# EAGLE design jtag (EAGLE 5.06)
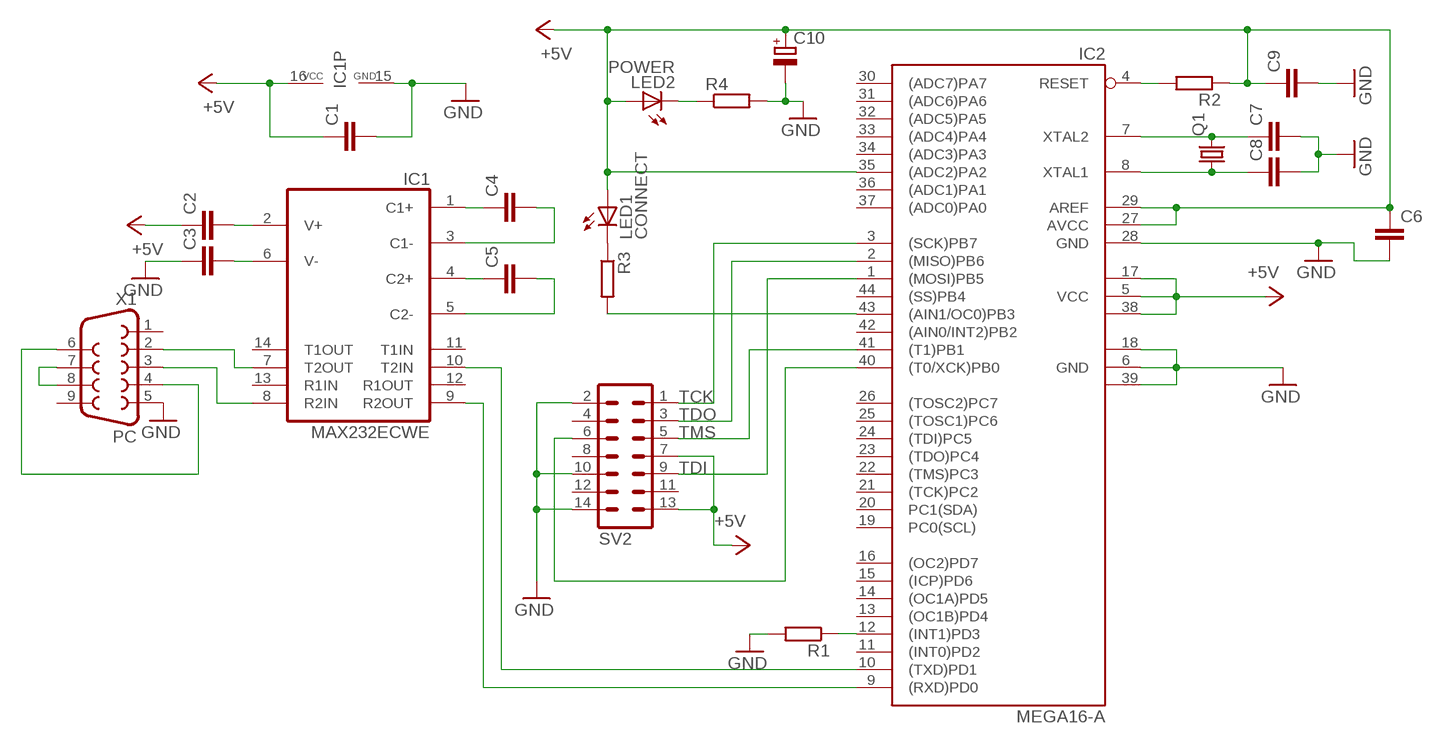
[diagram p0: schematic, sheet 1]

## Parts
C1  C-EUC0805  [C0805]
C2  C-EUC0805  [C0805]
C3  C-EUC0805  [C0805]
C4  C-EUC0805  [C0805]
C5  C-EUC0805  [C0805]
C6  C-EUC0805  [C0805]
C7  C-EUC0805  [C0805]
C8  C-EUC0805  [C0805]
C9  C-EUC0805  [C0805]
C10  CPOL-EUE5-5  [E5-5]
IC1  MAX232ECWE  [SO16L]
IC2  MEGA16-A  [TQFP44]
LED1  CONNECT  LEDCHIP-LED0805  [CHIP-LED0805]
LED2  POWER  LEDCHIP-LED0805  [CHIP-LED0805]
Q1  CRYSTALHC49S  [HC49/S]
R1  R-EU_R0805  [R0805]
R2  R-EU_R0805  [R0805]
R3  R-EU_R0805  [R0805]
R4  R-EU_R0805  [R0805]
SV2  MA07-2W  [MA07-2W]
X1  PC  F09HP  [F09HP]

## Nets
+5V: C1.1 C2.1 C6.1 C9.1 C10.+ IC1.16(VCC) IC2.5(VCC) IC2.17(VCC1) IC2.27(AVCC) IC2.29(AREF) IC2.35((ADC2)PA2) IC2.38(VCC2) LED1.A LED2.A R2.1 SV2.7 SV2.13
GND: C1.2 C3.1 C6.2 C7.2 C8.2 C9.2 C10.- IC1.15(GND) IC2.6(GND) IC2.18(GND1) IC2.28(GND) IC2.39(GND2) R1.2 R4.2 SV2.2 SV2.10 SV2.14 X1.5
N$1: X1.4 X1.6
N$2: X1.7 X1.8
N$3: IC1.7(T2OUT) X1.2
N$4: IC1.8(R2IN) X1.3
N$5: C5.2 IC1.5(C2-)
N$6: C2.2 IC1.2(V+)
N$7: C3.2 IC1.6(V-)
N$8: C4.1 IC1.1(C1+)
N$9: C4.2 IC1.3(C1-)
N$10: C5.1 IC1.4(C2+)
N$11: IC1.10(T2IN) IC2.10((TXD)PD1)
N$12: IC1.9(R2OUT) IC2.9((RXD)PD0)
N$13: IC2.12((INT1)PD3) R1.1
N$14: C7.1 IC2.7(XTAL2) Q1.2
N$15: C8.1 IC2.8(XTAL1) Q1.1
N$16: IC2.43((AIN1/OC0)PB3) R3.2
N$17: IC2.4(RESET) R2.2
N$18: LED1.C R3.1
N$20: IC2.40((T0/XCK)PB0) SV2.6
N$26: LED2.C R4.1
TCK: IC2.3((SCK)PB7) SV2.1
TDI: IC2.1((MOSI)PB5) SV2.9
TDO: IC2.2((MISO)PB6) SV2.3
TMS: IC2.41((T1)PB1) SV2.5
Unconnected: IC1.11(T1IN) IC1.12(R1OUT) IC1.13(R1IN) IC1.14(T1OUT) IC2.11((INT0)PD2) IC2.13((OC1B)PD4) IC2.14((OC1A)PD5) IC2.15((ICP)PD6) IC2.16((OC2)PD7) IC2.19(PC0(SCL)) IC2.20(PC1(SDA)) IC2.21((TCK)PC2) IC2.22((TMS)PC3) IC2.23((TDO)PC4) IC2.24((TDI)PC5) IC2.25((TOSC1)PC6) IC2.26((TOSC2)PC7) IC2.30((ADC7)PA7) IC2.31((ADC6)PA6) IC2.32((ADC5)PA5) IC2.33((ADC4)PA4) IC2.34((ADC3)PA3) IC2.36((ADC1)PA1) IC2.37((ADC0)PA0) IC2.42((AIN0/INT2)PB2) IC2.44((SS)PB4) SV2.4 SV2.8 SV2.11 SV2.12 X1.1 X1.9

## Library data of the parts
C1-C9 = rcl:C-EU: CAPACITOR, European symbol
C10 = rcl:CPOL-EU: POLARIZED CAPACITOR, European symbol
IC1 = maxim:MAX232ECWE: RS232 TRANSEIVER
IC2 = atmel:MEGA16: MICROCONTROLLER 16 Kbytes FLASH 1 kbytes SRAM 512 bytes EEPROM USART 8-channel 10 bit ADC Source: avr.lbr
LED1 LED2 = led:LED: LED OSRAM: - CHIPLED LG R971, LG N971, LY N971, LG Q971, LY Q971, LO R971, LY R971 LH N974, LH R974 LS Q976, LO Q976, LY Q976 LO Q996 - Hyper CHIPLED LW Q18S LB Q993, LB Q99A, LB R99A - SideLED LS A670, LO A670, LY A670, LG A670, LP A670 LB A673, LV A673, LT A673, LW A673 LH A674 LY A675 LS A676, LA A676, LO A676, LY A676, LW A676 LS A679, LY A679, LG A679 - Hyper Micro SIDELED® LS Y876, LA Y876, LO Y876, LY Y876 LT Y87S - SmartLED LW L88C, LW L88S LB L89C, LB L89S, LG L890 LS L89K, LO L89K, LY L89K LS L896, LA L896, LO L896, LY L896 - TOPLED LS T670, LO T670, LY T670, LG T670, LP T670 LSG T670, LSP T670, LSY T670, LOP T670, LYG T670 LG T671, LOG T671, LSG T671 LB T673, LV T673, LT T673, LW T673 LH T674 LS T676, LA T676, LO T676, LY T676, LB T676, LH T676, LSB T676, LW T676 LB T67C, LV T67C, LT T67C, LS T67K, LO T67K, LY T67K, LW E67C LS E67B, LA E67B, LO E67B, LY E67B, LB E67C, LV E67C, LT E67C LW T67C LS T679, LY T679, LG T679 LS T770, LO T770, LY T770, LG T770, LP T770 LB T773, LV T773, LT T773, LW T773 LH T774 LS E675, LA E675, LY E675, LS T675 LS T776, LA T776, LO T776, LY T776, LB T776 LHGB T686 LT T68C, LB T68C - Hyper Mini TOPLED® LB M676 - Mini TOPLED Santana® LG M470 LS M47K, LO M47K, LY M47K Source: http://www.osram.convergy.de LUXEON: - LUMILED® LXK2-PW12-R00, LXK2-PW12-S00, LXK2-PW14-U00, LXK2-PW14-V00 LXK2-PM12-R00, LXK2-PM12-S00, LXK2-PM14-U00 LXK2-PE12-Q00, LXK2-PE12-R00, LXK2-PE12-S00, LXK2-PE14-T00, LXK2-PE14-U00 LXK2-PB12-K00, LXK2-PB12-L00, LXK2-PB12-M00, LXK2-PB14-N00, LXK2-PB14-P00, LXK2-PB14-Q00 LXK2-PR12-L00, LXK2-PR12-M00, LXK2-PR14-Q00, LXK2-PR14-R00 LXK2-PD12-Q00, LXK2-PD12-R00, LXK2-PD12-S00 LXK2-PH12-R00, LXK2-PH12-S00 LXK2-PL12-P00, LXK2-PL12-Q00, LXK2-PL12-R00 Source: www.luxeon.com KINGBRIGHT: KA-3528ASYC Source: www.kingbright.com
Q1 = crystal:CRYSTAL: CRYSTAL
R1-R4 = rcl:R-EU_: RESISTOR, European symbol
SV2 = con-lstb:MA07-2W: PIN HEADER
X1 = con-subd:F09: SUB-D

## Board
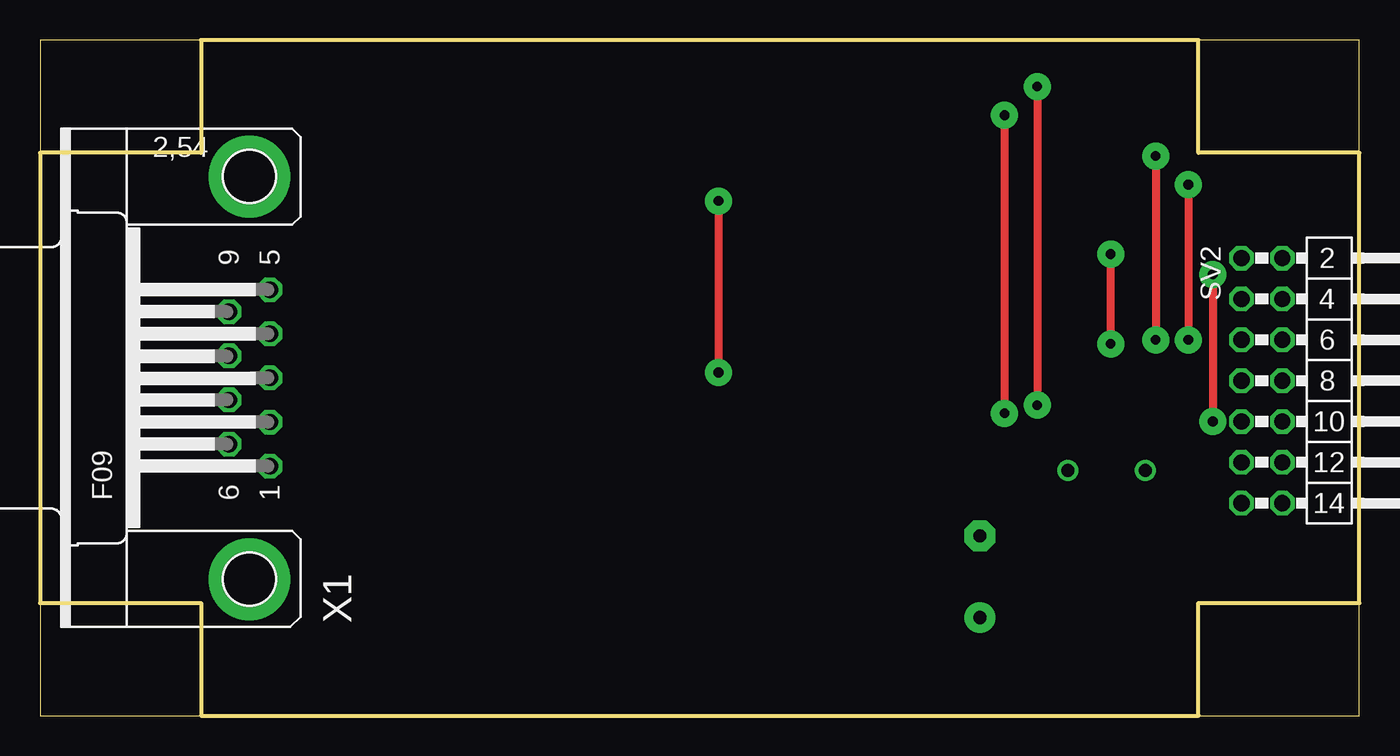
[diagram p1: board, top side]
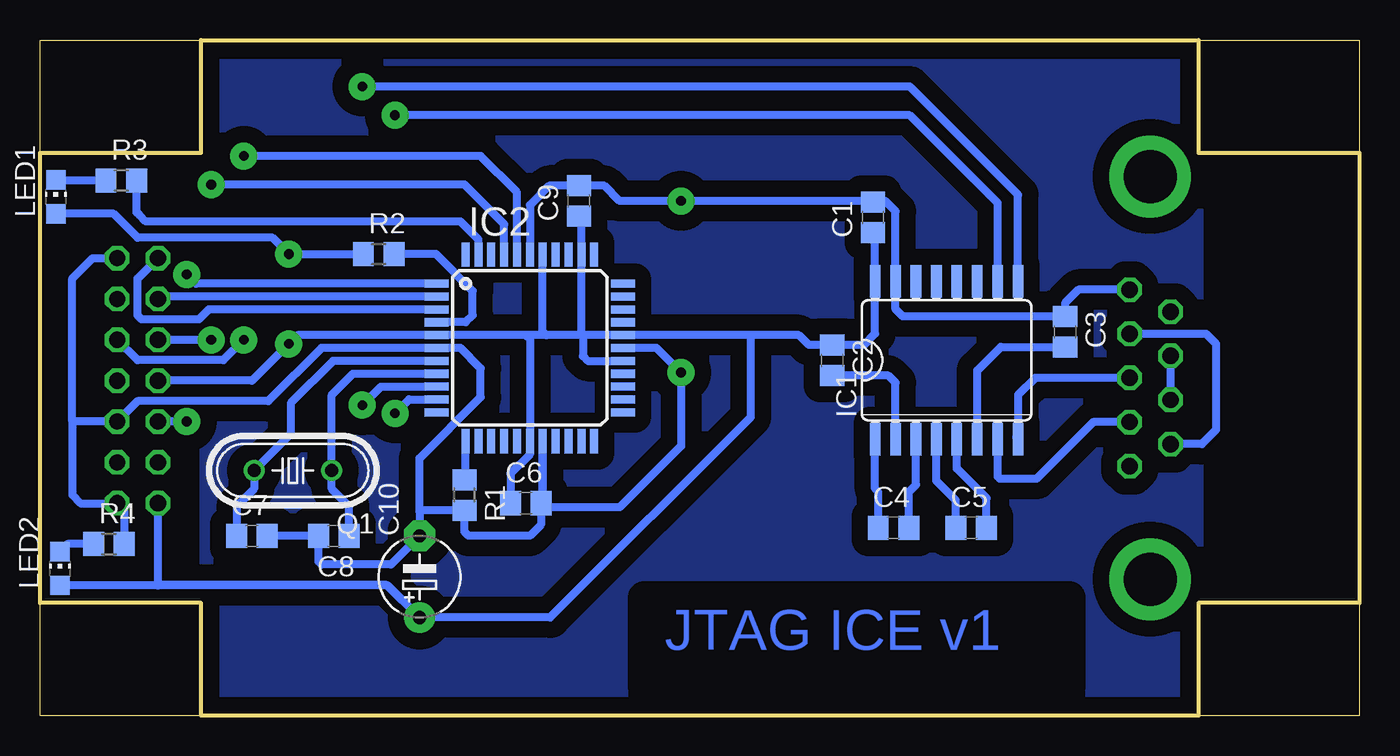
[diagram p2: board, bottom side, seen from below]

Size 82 x 42 mm. Coordinates in mm from the lower left corner, seen from the top.
Outline: 10,0 0,0 0,7
Outline: 72,0 82,0 82,7
Outline: 82,35 82,42 72,42
Outline: 10,42 0,42 0,35
Outline: 0,7 10,7 10,0
Outline: 10,0 72,0
Outline: 72,0 72,7 82,7
Outline: 82,7 82,35
Outline: 82,35 72,35 72,42
Outline: 72,42 10,42
Outline: 10,42 10,35 0,35
Outline: 0,35 0,7
Copper layers (1*16): Top 0.035mm / dielectric 1.5mm / Bottom 0.035mm
Design rules "default": minimum track width 10mil, minimum drill 24mil, track to track 8mil, track to pad 8mil, pad to pad 8mil, via to via 8mil, smd to smd 8mil, copper to edge 40mil, drill to drill 8mil, minimum pad ring 10mil, minimum via ring 8mil, stop-mask expansion 4mil, vias tented up to drill 0mil, thermal gap 10mil
bRestrict: area 18,1.8 to 44.5,7.4

### Footprints (pad centres in the part's own frame; a part is rotated, then mirrored left to right if it is on the bottom)
C0805 = smd 1.3 x 1.5: 1 -0.95,0; 2 0.95,0
E5-5 = drill 0.813 pad 1.905 round: + -2.54,0 | drill 0.813 pad 1.905 octagon: - 2.54,0
SO16L = smd 0.66 x 2.032: 1 -4.445,-4.902; 2 -3.175,-4.902; 3 -1.905,-4.902; 4 -0.635,-4.902; 5 0.635,-4.902; 6 1.905,-4.902; 7 3.175,-4.902; 8 4.445,-4.902; 9 4.445,4.902; 10 3.175,4.902; 11 1.905,4.902; 12 0.635,4.902; 13 -0.635,4.902; 14 -1.905,4.902; 15 -3.175,4.902; 16 -4.445,4.902
TQFP44 = smd 1.5 x 0.5: 1 -5.8,4; 2 -5.8,3.2; 3 -5.8,2.4; 4 -5.8,1.6; 5 -5.8,0.8; 6 -5.8,0; 7 -5.8,-0.8; 8 -5.8,-1.6; 9 -5.8,-2.4; 10 -5.8,-3.2; 11 -5.8,-4; 23 5.8,-4; 24 5.8,-3.2; 25 5.8,-2.4; 26 5.8,-1.6; 27 5.8,-0.8; 28 5.8,0; 29 5.8,0.8; 30 5.8,1.6; 31 5.8,2.4; 32 5.8,3.2; 33 5.8,4 | smd 0.5 x 1.5: 12 -4,-5.8; 13 -3.2,-5.8; 14 -2.4,-5.8; 15 -1.6,-5.8; 16 -0.8,-5.8; 17 0,-5.8; 18 0.8,-5.8; 19 1.6,-5.8; 20 2.4,-5.8; 21 3.2,-5.8; 22 4,-5.8; 34 4,5.8; 35 3.2,5.8; 36 2.4,5.8; 37 1.6,5.8; 38 0.8,5.8; 39 0,5.8; 40 -0.8,5.8; 41 -1.6,5.8; 42 -2.4,5.8; 43 -3.2,5.8; 44 -4,5.8
CHIP-LED0805 = smd 1.2 x 1.2: A 0,-1.05; C 0,1.05
HC49/S = drill 0.813 round: 1 -2.413,0; 2 2.413,0
R0805 = smd 1.3 x 1.5: 1 -0.95,0; 2 0.95,0
MA07-2W = drill 1.016 octagon: 1 -7.62,-1.27; 2 -7.62,1.27; 3 -5.08,-1.27; 4 -5.08,1.27; 5 -2.54,-1.27; 6 -2.54,1.27; 7 0,-1.27; 8 0,1.27; 9 2.54,-1.27; 10 2.54,1.27; 11 5.08,-1.27; 12 5.08,1.27; 13 7.62,-1.27; 14 7.62,1.27
F09HP = drill 1.016 octagon: 1 -5.486,-1.27; 2 -2.743,-1.27; 3 0,-1.27; 4 2.743,-1.27; 5 5.486,-1.27; 6 -4.115,1.27; 7 -1.372,1.27; 8 1.372,1.27; 9 4.115,1.27 | drill 3.302 pad 5.08 round: G1 -12.522,0; G2 12.522,0

### Placement (x,y rotation side)
C1  30.23,30.99 90 bottom
C2  32.77,22.1 270 bottom
C3  18.29,23.88 270 bottom
C4  28.96,11.68 0 bottom
C5  24.13,11.68 0 bottom
C6  51.82,13.21 0 bottom
C7  68.83,11.18 0 bottom
C8  63.75,11.18 180 bottom
C9  48.51,32 90 bottom
C10  58.42,8.64 90 bottom
IC1  25.65,22.1 0 bottom
IC2  51.56,22.86 0 bottom
LED1  81.03,32.26 0 bottom
LED2  80.77,9.14 0 bottom
Q1  66.29,15.24 180 bottom
R1  55.63,13.72 270 bottom
R2  60.96,28.7 0 bottom
R3  76.96,33.27 0 bottom
R4  77.72,10.67 0 bottom
SV2  75.95,20.83 270 top
X1  13,21 90 top

### Tracks (layer width: path | path; a pad name or v marks a point on that pad's centre or on a via)
+5V  (via drill 0.6 pad 1.68)
  Top 0.508: v66.55,23.11 v66.55,28.7
  Bottom 0.508: SV2.7 68.83,20.83 v66.55,23.11 66,23.66 IC2.5 51.82,23.66 | 48.26,23.66 IC2.29 37.85,23.66 | 48.26,23.66 50.55,23.66 | 50.55,23.66 51.82,23.66 | IC2.38 50.76,23.88 50.55,23.66 | C6.1 52.77,15.05 51.56,16.26 IC2.17 51.56,23.41 51.82,23.66 | 37.85,23.66 34.84,23.66 34.22,23.05 C2.1 30.8,23.05 30.1,23.75 IC1.16 30.1,29.91 C1.1 | R2.1 v66.55,28.7 67.56,29.72 75.95,29.72 77.44,31.21 LED1.A | 74.68,8.09 60.42,8.09 C10.+ | 74.68,8.09 LED2.A | 74.68,8.13 74.68,8.09 | 48.26,23.66 48.36,23.76 IC2.35 48.36,30.9 C9.1 | IC2.27 47.97,22.06 48.26,22.35 48.26,23.66 | 74.68,8.13 SV2.13 | 74.68,8.13 60.45,8.13 C10.+ | C10.+ 50.29,6.1 37.85,18.54 37.85,23.66
GND  (via drill 0.6 pad 1.68)
  Top 0.508: v42.16,32 v42.16,21.34
  Bottom 0.508: X1.5 17.46,26.49 18.29,25.65 C3.1 28.38,24.83 28.83,25.27 | 28.83,25.27 IC1.15 28.83,31.37 | C7.2 C8.2 64.7,9.59 64.52,9.4 60.2,9.4 C10.- 58.42,12.7 | 80.01,18.29 80.01,13.72 79.5,13.21 SV2.14 76.77,12.77 R4.2 | 80.01,18.29 SV2.10 75.95,19.56 67.82,19.56 64.52,22.86 IC2.6 55.88,22.86 54.61,21.59 54.61,19.81 58.42,16 58.42,12.7 | SV2.2 78.74,28.45 80.01,27.18 80.01,18.29 | 58.42,12.7 58.35,12.77 R1.2 55.63,11.43 55.37,11.18 51.56,11.18 50.87,11.87 C6.2 50.76,13.31 IC2.18 50.76,12.99 50.8,12.95 45.97,12.95 42.16,16.76 v42.16,21.34 43.69,22.86 IC2.28 | IC2.39 51.56,31.75 50.36,32.95 C9.2 46.92,32.95 45.97,32 v42.16,32 29.97,32 | 29.97,32 30.16,32 C1.2 | 28.83,25.27 28.83,31.37 | 28.83,31.37 29.46,32 29.97,32
N$1
  Bottom 0.508: X1.4 9.52,23.74 8.89,23.11 8.89,17.78 9.79,16.89 X1.6
N$2
  Bottom 0.508: X1.7 X1.8
N$3
  Bottom 0.508: IC1.7 22.48,14.86 22.35,14.73 20.07,14.73 16.54,18.26 X1.2
N$4
  Bottom 0.508: 21.34,17.32 IC1.8 21.21,19.94 20.15,21 X1.3
N$5
  Bottom 0.508: IC1.5 25.02,15.37 23.18,13.53 C5.2
N$6
  Bottom 0.508: IC1.2 28.83,20.7 29.28,21.15 C2.2
N$7
  Bottom 0.508: C3.2 22.29,22.93 23.75,21.46 IC1.6
N$8
  Bottom 0.508: C4.1 29.91,13.9 30.1,14.1 IC1.1
N$9
  Bottom 0.508: IC1.3 27.56,14.35 28.01,13.9 C4.2
N$10
  Bottom 0.508: IC1.4 26.29,14.61 25.08,13.4 C5.1
N$11  (via drill 0.6 pad 1.68)
  Top 0.508: v59.94,18.8 59.94,36.83 v59.94,37.34
  Bottom 0.508: IC2.10 59.08,19.66 v59.94,18.8 | IC1.10 22.48,31.88 27.94,37.34 v59.94,37.34
N$12  (via drill 0.6 pad 1.68)
  Top 0.508: v61.98,39.12 v61.98,19.3
  Bottom 0.508: IC1.9 21.21,32.38 27.94,39.12 v61.98,39.12 | IC2.9 60.82,20.46 v61.98,19.3
N$13
  Bottom 0.508: IC2.12 55.56,14.73 R1.1
N$14
  Bottom 0.508: IC2.7 63.79,22.06 66.42,19.43 66.42,17.53 Q1.2 68.71,14.1 69.78,13.02 C7.1
N$15
  Bottom 0.508: IC2.8 62.56,21.26 63.88,19.94 Q1.1 63.88,14.1 62.8,13.02 C8.1
N$16
  Bottom 0.508: IC2.43 54.76,29.62 55.88,30.73 75.44,30.73 75.82,31.11 | 75.82,31.11 75.95,31.24 | R3.2 76.01,31.31 75.82,31.11
N$17
  Bottom 0.508: IC2.4 55.55,24.46 55.12,24.89 55.12,26.42 57.4,28.7 R2.2
N$18
  Bottom 0.508: R3.1 80.99,33.27 LED1.C
N$19
  pour Bottom (isolate 1.016): 9.91,41.91 71.88,41.91 71.88,0 9.91,0
N$20  (via drill 0.6 pad 1.68)
  Top 0.508: v69.34,34.8 v69.34,23.37
  Bottom 0.508: SV2.6 75.95,22.1 70.61,22.1 v69.34,23.37 | IC2.40 52.36,32.55 54.61,34.8 v69.34,34.8
N$26
  Bottom 0.508: R4.1 80.3,10.67 LED2.C
TCK
  Bottom 0.508: SV2.1 75.95,27.18 75.95,24.89 75.69,24.64 72.14,24.64 71.51,25.26 IC2.3
TDI  (via drill 0.6 pad 1.68)
  Top 0.508: v72.9,27.43 v72.9,18.29
  Bottom 0.508: IC2.1 72.33,26.86 v72.9,27.43 | v72.9,18.29 SV2.9
TDO
  Bottom 0.508: IC2.2 74.52,26.06 SV2.3
TMS  (via drill 0.6 pad 1.68)
  Top 0.508: v71.37,33.02 v71.37,23.37
  Bottom 0.508: v71.37,23.37 SV2.5 | IC2.41 53.16,30.56 55.63,33.02 v71.37,33.02

### Text on the board
Bottom: JTAG ICE v1